# EAGLE design remote_control (EAGLE 7.1.0)
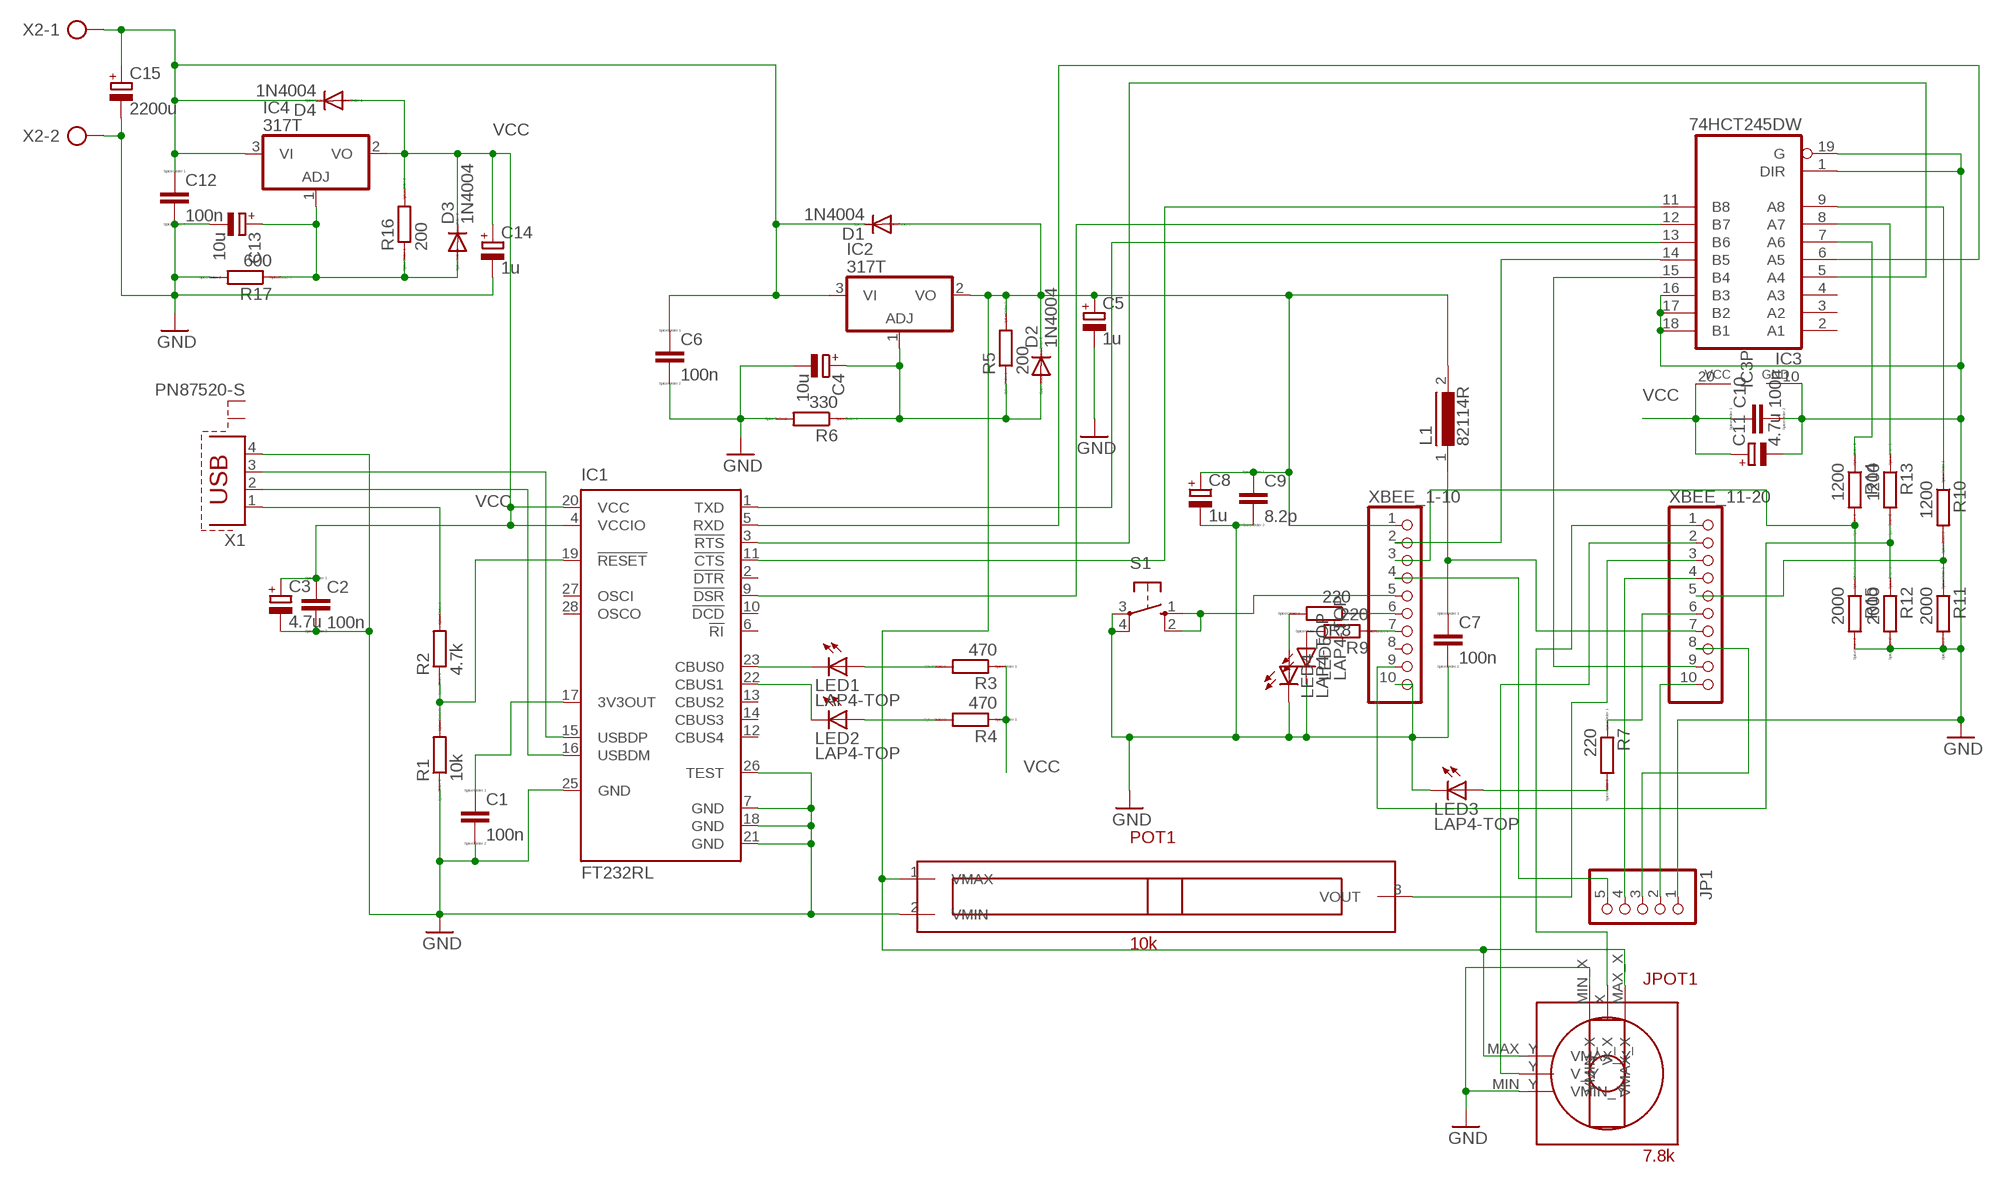
[diagram p0: schematic, sheet 1]

## Parts
C1  100n  C-EU025-030X050  [C025-030X050]
C2  100n  C-EUC0805K  [C0805K]
C3  4.7u  CPOL-EU153CLV-0605  [153CLV-0605]
C4  10u  CPOL-EUE5-8.5  [E5-8,5]
C5  1u  CPOL-EUE5-8.5  [E5-8,5]
C6  100n  C-EU025-030X050  [C025-030X050]
C7  100n  C-EU025-030X050  [C025-030X050]
C8  1u  CPOL-EUE5-8.5  [E5-8,5]
C9  8.2p  C-EU025-030X050  [C025-030X050]
C10  100n  C-EUC0805K  [C0805K]
C11  4.7u  CPOL-EU153CLV-0605  [153CLV-0605]
C12  100n  C-EU025-030X050  [C025-030X050]
C13  10u  CPOL-EUE5-8.5  [E5-8,5]
C14  1u  CPOL-EUE5-8.5  [E5-8,5]
C15  2200u  CPOL-EUE10-20  [EB20D]
D1  1N4004  [DO41-10]
D2  1N4004  [DO41-10]
D3  1N4004  [DO41-10]
D4  1N4004  [DO41-10]
IC1  FT232RL  [SSOP28]
IC2  317T  [TO220H]
IC3  74HCT245DW  [SO20W]
IC4  317T  [TO220H]
JP1  PINHD-1X5  [1X05]
JPOT1  7.8k  JOYSTICK_POTIP  [DIL]
L1  82114R  [82114R]
LED1  LAP4-TOP  [P47F-TOP]
LED2  LAP4-TOP  [P47F-TOP]
LED3  LAP4-TOP  [P47F-TOP]
LED4  LAP4-TOP  [P47F-TOP]
LED5  LAP4-TOP  [P47F-TOP]
POT1  10k  SCHIEBEPOTENTIOMETER  [DIL]
R1  10k  R-EU_0207_10  [0207/10]
R2  4.7k  R-EU_0207_10  [0207/10]
R3  470  R-EU_0207_10  [0207/10]
R4  470  R-EU_0207_10  [0207/10]
R5  200  R-EU_0411_15  [0411/15]
R6  330  R-EU_0411_15  [0411/15]
R7  220  R-EU_0207_10  [0207/10]
R8  220  R-EU_0207_10  [0207/10]
R9  220  R-EU_0207_10  [0207/10]
R10  1200  R-EU_0207_10  [0207/10]
R11  2000  R-EU_0207_10  [0207/10]
R12  2000  R-EU_0207_10  [0207/10]
R13  1200  R-EU_0207_10  [0207/10]
R14  1200  R-EU_0207_10  [0207/10]
R15  2000  R-EU_0207_10  [0207/10]
R16  200  R-EU_0411_15  [0411/15]
R17  600  R-EU_0411_15  [0411/15]
S1  40-XX  [B3F-40XX]
X1  PN87520-S  [PN87520-S]
X2  AK300/2  [AK300/2]
XBEE_1-10  PINHD-1X10M  [1X10M]
XBEE_11-20  PINHD-1X10M  [1X10M]

## Nets
GND: C1.2 C2.2 C3.- C4.- C5.- C6.2 C7.2 C8.- C9.2 C10.2 C11.- C12.2 C13.- C14.- C15.- IC1.7(GND) IC1.18(GND) IC1.21(GND) IC1.25(GND) IC1.26(TEST) IC3.1(DIR) IC3.10(GND) IC3.16(B3) IC3.17(B2) IC3.18(B1) IC3.19(G) JP1.1 JPOT1.MIN_X(VMIN_X) JPOT1.MIN_Y(VMIN_Y) LED3.C LED4.C LED5.C POT1.2(VMIN) R1.1 R6.2 R11.2 R12.2 R15.2 R17.2 S1.3(P) S1.4(P1) X1.4 X2.2 XBEE_1-10.10
N$1: R2.2 X1.1
N$2: IC1.19(!RESET) R1.2 R2.1
N$3: IC1.16(USBDM) X1.2
N$4: IC1.15(USBDP) X1.3
N$5: C1.1 IC1.17(3V3OUT)
N$6: S1.1(S) S1.2(S1) XBEE_1-10.5
N$7: C4.+ D2.A IC2.1(ADJ) R5.1 R6.1
N$8: LED3.A R7.2
N$9: IC1.23(CBUS0) LED1.C
N$10: IC1.22(CBUS1) LED2.C
N$11: LED1.A R3.2
N$12: LED2.A R4.2
N$13: R7.1 XBEE_11-20.6
N$14: C7.1 L1.1 XBEE_11-20.7
N$15: C5.+ C8.+ C9.1 D1.A D2.C IC2.2(VO) JPOT1.MAX_X(VMAX_X) JPOT1.MAX_Y(VMAX_Y) L1.2 POT1.1(VMAX) R5.2 XBEE_1-10.1
N$16: R8.1 XBEE_1-10.6
N$17: LED4.A R8.2
N$18: R9.1 XBEE_1-10.7
N$19: LED5.A R9.2
N$20: IC3.9(A8) R10.1
N$21: R10.2 R11.1 XBEE_11-20.5
N$22: R12.1 R13.2 XBEE_1-10.9
N$23: IC1.11(!CTS) IC3.11(B8)
N$24: IC3.8(A7) R13.1
N$25: IC1.9(!DSR) IC3.12(B7)
N$26: R14.2 R15.1 XBEE_1-10.3
N$27: IC3.7(A6) R14.1
N$28: JP1.2 XBEE_11-20.10
N$29: IC1.1(TXD) IC3.13(B6)
N$30: IC1.5(RXD) IC3.6(A5)
N$31: IC3.14(B5) XBEE_1-10.2
N$32: IC1.3(!RTS) IC3.5(A4)
N$33: IC3.15(B4) XBEE_11-20.9
N$34: JP1.3 XBEE_11-20.8
N$35: JP1.4 XBEE_11-20.4
N$36: JP1.5 XBEE_1-10.4
N$37: POT1.3(VOUT) XBEE_11-20.3
N$38: JPOT1.X(V_X) XBEE_11-20.1
N$39: JPOT1.Y(V_Y) XBEE_11-20.2
N$40: C13.+ D3.A IC4.1(ADJ) R16.1 R17.1
V: C6.1 C12.1 C15.+ D1.C D4.C IC2.3(VI) IC4.3(VI) X2.1
VCC: C2.1 C3.+ C10.1 C11.+ C14.+ D3.C D4.A IC1.4(VCCIO) IC1.20(VCC) IC3.20(VCC) IC4.2(VO) R3.1 R4.1 R16.2
Unconnected: IC1.2(!DTR) IC1.6(!RI) IC1.10(!DCD) IC1.12(CBUS4) IC1.13(CBUS2) IC1.14(CBUS3) IC1.27(OSCI) IC1.28(OSCO) IC3.2(A1) IC3.3(A2) IC3.4(A3) X1.S1 X1.S2 XBEE_1-10.8

## Library data of the parts
C1 C2 C6 C7 C9 C10 C12 = resistor:C-EU: CAPACITOR, European symbol; SPICEPREFIX: C
C3-C5 C8 C11 C13-C15 = resistor:CPOL-EU: POLARIZED CAPACITOR, European symbol
D1-D4 = diode:1N4004: DIODE general purpose rectifier, 1 A
IC1 = ftdichip:FT232R: Source: http://www.ftdichip.com/Documents/DataSheets/DS_FT232R_v104.pdf; MPN: FT232RL; OC_FARNELL: 1146032; OC_NEWARK: 91K9918
IC2 IC4 = linear:*317: Positive VOLTAGE REGULATOR
IC3 = 74xx-eu:74*245: Octal BUS TRANSCEIVER, 3-state
JP1 = pinhead:PINHD-1X5: PIN HEADER
JPOT1 = joystick:JOYSTICK_POTI
L1 = inductors:82114R: INDUCTOR
LED1-LED5 = led:*P4: PointLED® Enhanced Thinfilm LED TOP & BOTTOM mount LS P47F, LR P47F, LA P47F, LY P47F, LT P4SG, LB P4SG, LW P4SG Source: http://catalog.osram-os.com .. LA_LR_LS_LY_P47F_Pb_free.pdf
POT1 = Schiebepotentiometer:SCHIEBEPOTENTIOMETER
R1-R17 = resistor:R-EU_: RESISTOR, European symbol; SPICEPREFIX: R
S1 = switch-omron:40-XX: OMRON SWITCH; MF: OMRON COMPONENTS USA; MPN: B3F-4000; OC_FARNELL: 176434; OC_NEWARK: 36K3105
X1 = con-berg:PN87520-S; OC_FARNELL: unknown; OC_NEWARK: unknown
X2 = con-ptr500:AK300/2: CONNECTOR; OC_FARNELL: unknown; OC_NEWARK: unknown
XBEE_1-10 XBEE_11-20 = pinhead:PINHD-1X10: PIN HEADER

## Board
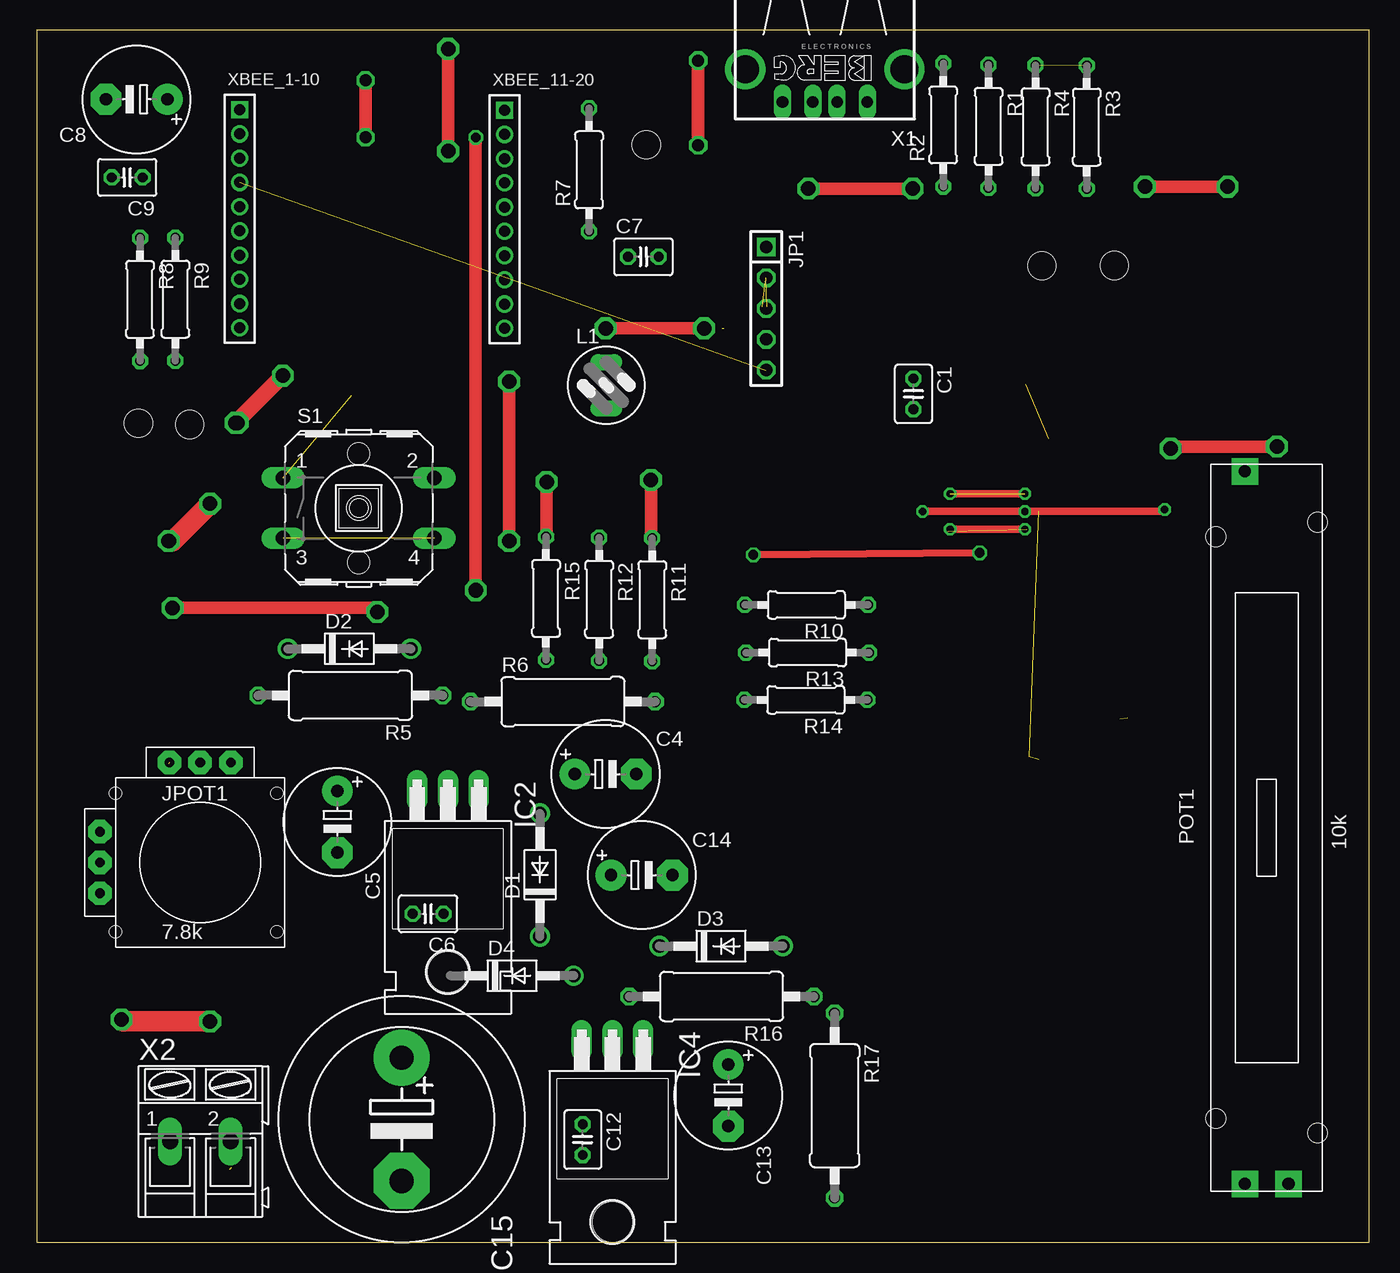
[diagram p1: board, top side]
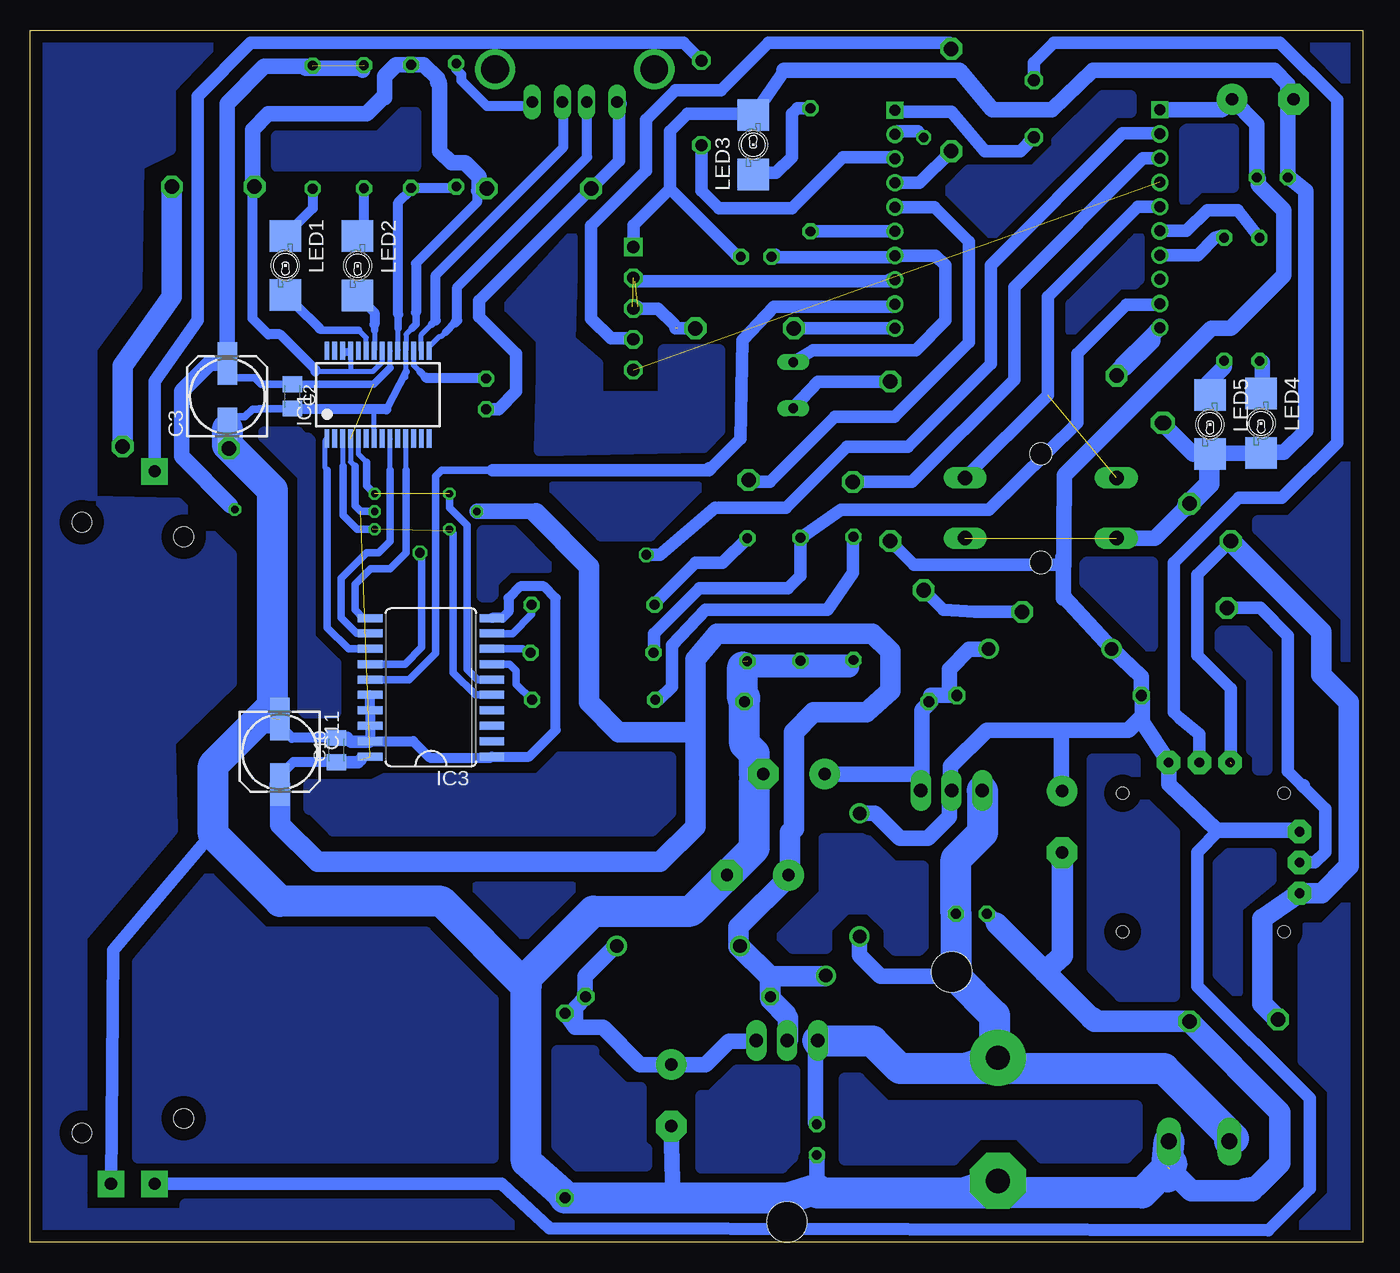
[diagram p2: board, bottom side, seen from below]

Size 110 x 100 mm. Coordinates in mm from the lower left corner, seen from the top.
Outline: 0,0 110,0 110,100 0,100 0,0
Copper layers (1*16): Top 0.035mm / dielectric 1.5mm / Bottom 0.035mm
Design rules "default": minimum track width 10mil, minimum drill 24mil, track to track 8mil, track to pad 8mil, pad to pad 8mil, via to via 8mil, smd to smd 8mil, copper to edge 40mil, drill to drill 8mil, minimum pad ring 10mil, minimum via ring 8mil, stop-mask expansion 4mil, vias tented up to drill 0mil, thermal gap 10mil

### Footprints (pad centres in the part's own frame; a part is rotated, then mirrored left to right if it is on the bottom)
C025-030X050 = drill 0.813 octagon: 1 -1.27,0; 2 1.27,0
C0805K = smd 1.3 x 1.6: 1 -1,0; 2 1,0
153CLV-0605 = smd 3.5 x 1.6: + 2.7,0; - -2.7,0
E5-8,5 = drill 1.016 pad 2.54: + -2.54,0 | drill 1.016 pad 2.54 octagon: - 2.54,0
EB20D = drill 2.007 pad 4.597: + -5.08,0 | drill 2.007 pad 4.597 octagon: - 5.08,0
DO41-10 = drill 1.118: A 5.08,0; C -5.08,0
SSOP28 = smd 0.4 x 1.5: 1 -4.225,-3.625; 2 -3.575,-3.625; 3 -2.925,-3.625; 4 -2.275,-3.625; 5 -1.625,-3.625; 6 -0.975,-3.625; 7 -0.325,-3.625; 8 0.325,-3.625; 9 0.975,-3.625; 10 1.625,-3.625; 11 2.275,-3.625; 12 2.925,-3.625; 13 3.575,-3.625; 14 4.225,-3.625; 15 4.225,3.625; 16 3.575,3.625; 17 2.925,3.625; 18 2.275,3.625; 19 1.625,3.625; 20 0.975,3.625; 21 0.325,3.625; 22 -0.325,3.625; 23 -0.975,3.625; 24 -1.625,3.625; 25 -2.275,3.625; 26 -2.925,3.625; 27 -3.575,3.625; 28 -4.225,3.625
TO220H = drill 1.118 long: 1 -2.54,-10.16; 2 0,-10.16; 3 2.54,-10.16 | hole 3.302: 0,4.826
SO20W = smd 0.66 x 2.032: 1 -5.715,-5.029; 2 -4.445,-5.029; 3 -3.175,-5.029; 4 -1.905,-5.029; 5 -0.635,-5.029; 6 0.635,-5.029; 7 1.905,-5.029; 8 3.175,-5.029; 9 4.445,-5.029; 10 5.715,-5.029; 11 5.715,5.029; 12 4.445,5.029; 13 3.175,5.029; 14 1.905,5.029; 15 0.635,5.029; 16 -0.635,5.029; 17 -1.905,5.029; 18 -3.175,5.029; 19 -4.445,5.029; 20 -5.715,5.029
1X05 = drill 1.016 square: 1 -5.08,0 | drill 1.016 octagon: 2 -2.54,0; 3 0,0; 4 2.54,0; 5 5.08,0
DIL = drill 0.8 pad 1.93 octagon: MAX_X 2.54,8.255; MAX_Y -8.255,2.54; MIN_X -2.54,8.255; MIN_Y -8.255,-2.54; X 0,8.255; Y -8.255,0 | hole 1: 6.35,5.715; 6.35,-5.715; -6.985,-5.715; -6.985,5.715
82114R = drill 0.813 long: 1 0,1.905; 2 0,-1.905
P47F-TOP = smd 2.6 x 2.6: A -2.45,0; C 2.45,0 | hole 2.3: 0,0
DIL' = drill 1 pad 2.184 square: 1 -29.4,1.8; 2 -29.4,-1.8; 3 29.4,1.8 | hole 1.6: 25.2,-4.2; -25.2,-4.2; 24,4.2; -24,4.2
0207/10 = drill 0.813 octagon: 1 -5.08,0; 2 5.08,0
0411/15 = drill 0.914 octagon: 1 -7.62,0; 2 7.62,0
B3F-40XX = drill 1.194 long: 1 -6.248,2.489; 2 6.248,2.489; 3 -6.248,-2.489; 4 6.248,-2.489 | hole 1.803: 0,-4.496; 0,4.496
PN87520-S = drill 0.95 long: 1 -3.5,2.71; 2 -1,2.71; 3 1,2.71; 4 3.5,2.71 | drill 2.3 pad 2.9: S1 -6.57,0; S2 6.57,0
AK300/2 = drill 1.321 long: 1 -2.515,0; 2 2.489,0
1X10M = drill 0.914 square: 1 -9,0 | drill 0.914: 2 -7,0; 3 -5,0; 4 -3,0; 5 -1,0; 6 1,0; 7 3,0; 8 5,0; 9 7,0; 10 9,0

### Placement (x,y rotation side)
C1  72.37,69.99 270 top
C2  88.34,69.78 270 bottom
C3  93.74,69.81 90 bottom
C4  46.95,38.62 0 top
C5  24.81,34.67 270 top
C6  32.3,27.08 180 top
C7  50.08,81.31 0 top
C8  8.24,94.31 180 top
C9  7.46,87.85 180 top
C10  84.72,40.6 90 bottom
C11  89.4,40.45 270 bottom
C12  45.07,8.45 270 top
C13  57.09,12.1 270 top
C14  49.95,30.28 0 top
C15  30.12,10.13 270 top
D1  41.54,30.3 90 top
D2  25.8,48.95 0 top
D3  56.49,24.42 0 top
D4  39.24,21.98 0 top
IC1  81.29,69.93 0 bottom
IC2  33.94,27.11 180 top
IC3  76.92,45.78 90 bottom
IC4  47.52,6.47 180 top
JP1  60.21,77.03 270 top
JPOT1  13.48,31.32 0 top
L1  47.02,70.71 0 top
LED1  88.94,80.59 270 bottom
LED2  82.98,80.56 270 bottom
LED3  50.31,90.55 90 bottom
LED4  8.39,67.56 270 bottom
LED5  12.62,67.47 270 bottom
POT1  10k  [DIL']  101.53,34.2 90 top
R1  78.57,92.06 270 top
R2  74.83,92.19 90 top
R3  86.68,92.01 270 top
R4  82.45,92.04 270 top
R5  25.89,45.1 180 top
R6  43.43,44.6 0 top
R7  45.59,88.47 90 top
R8  8.52,77.79 270 top
R9  11.44,77.81 270 top
R10  63.54,52.58 180 top
R11  50.81,53.01 270 top
R12  46.42,53.04 270 top
R13  63.62,48.64 180 top
R14  63.49,44.74 180 top
R15  42.03,53.11 270 top
R16  56.53,20.26 180 top
R17  65.87,11.26 270 top
S1  26.58,60.57 0 top
X1  65.06,96.8 180 top
X2  13.51,8.3 0 top
XBEE_1-10  16.74,84.44 270 top
XBEE_11-20  38.62,84.41 270 top

### Tracks (layer width: path | path; a pad name or v marks a point on that pad's centre or on a via)
GND  (via drill 1.2)  (5 unrouted)
  Top 1.016: v63.7,86.94 v72.31,86.94
  Top 1.27: v16.41,67.6 v20.31,71.5
  Top 1.676: v14.3,18.2 7.15,18.2 v6.99,18.36 | v10.89,57.85 11.21,57.85 v14.3,60.94
  Bottom 0.406: IC1.7 81.61,68.7 | 78.97,73.52 IC1.18 78.97,73.59 | 78.49,75.4 78.97,74.91 78.97,73.59 | IC1.26 IC1.25 83.56,71.86 83.53,71.83 | 80.97,72.6 80.92,72.64 80.92,73.52 IC1.21 80.97,72.6 | 80.97,72.6 81.74,71.83 83.53,71.83 | 83.53,71.83 86.45,71.83 | 78.97,71.34 78.97,71.83 78.97,73.59
  Bottom 0.61: 81.61,68.7 81.7,68.78 C2.2 91.12,68.78 91.16,68.74 91.65,68.74 92.3,68.09 93.44,68.09 93.76,68.41 93.76,67.13 C3.- | 78.16,76.7 78.16,75.72 78.49,75.4 | 80.6,68.72 78.97,71.83
  Bottom 0.813: C10.2 88.4,41.6 89.38,42.58 89.38,43.13 C11.- | IC3.16 IC3.17 IC3.18 IC3.19 78.39,41.34 77.03,39.98 71.98,39.98 IC3.1 68.81,40.06 66.62,42.25 66.62,53.14 67.6,54.11 69.55,54.11 70.53,53.14 70.53,52 71.01,51.51 71.87,51.51 IC3.10 | 74.1,89.05 75.4,89.05 76.05,89.7 76.05,95.88 77.35,97.17 77.38,97.14 R1.1 78.6,97.17 79.95,97.17 80.76,96.36 80.76,96.2 | 73.12,88.08 73.12,86.78 73.12,85.8 78.16,80.76 78.16,76.7 | 86.45,71.83 86.45,71.99 89.38,74.91 90.35,74.91 91.65,76.21 91.65,87.1 | 91.65,91.81 91.65,91.97 90.51,93.11 90.35,93.11 | 82.22,93.11 82.06,93.11 80.76,94.41 | 80.6,68.72 88.28,68.72 C2.2 | R15.2 51.35,48.1 51.13,47.88 51.13,45.33 R6.2
  Bottom 1.016: C10.2 83.85,41.6 83.53,41.27 82.01,41.27 IC3.19 | POT1.2 103.17,24.07 94.9,33.8 | R12.2 50.78,47.96 R11.2 | 47.77,96.69 47.72,96.75 LED3.C 50.42,93.11 55.74,93.11 57.2,91.65 57.2,86.94 | 10.89,39.49 11.21,39.49 10.89,39.81 10.89,45.66 13.65,48.42 13.65,55.09 v10.89,57.85 | 61.4,93.92 61.4,89.24 v63.7,86.94 72.96,77.67 72.96,76.38 69.88,73.29 69.88,70.2 71.36,68.72 C1.2 | v72.31,86.94 72.96,86.94 73.12,86.78 | C7.2 51.73,81.47 57.2,86.94 | JP1.1 60.21,83.93 57.2,86.94
  Bottom 1.27: 45.07,4.12 45.07,4.39 C12.2 | C13.- 56.93,3.58 56.55,3.64 | 16.09,5.36 16.09,5.2 | 22.48,18.52 26.27,22.32 C6.2 | 6.19,93.81 C9.2 6.12,87.85 4.71,86.78 4.71,66.95 6.5,65.16 8.33,65.16 LED4.C 12.53,65.11 LED5.C | 6.19,93.81 C8.- | LED5.C 13.99,65.02 16.57,67.6 v16.41,67.6 | v20.31,71.5 20.31,71.88 XBEE_1-10.10 | S1.3 17.15,58.08 14.46,60.77 v14.3,60.94 12.68,62.56 12.68,64.96 LED5.C | 6.19,93.81 6.19,95.57 7.31,96.69 22.26,96.69 25.68,93.44 30.55,93.44 33.31,96.69 47.77,96.69 | 61.4,93.92 X1.4 | 91.65,87.1 91.65,91.81 90.35,93.11 82.22,93.11 80.92,94.41 80.76,94.41 80.76,96.2 79.79,97.17 77.51,97.17 76.38,96.04 76.38,95.71 76.21,95.55 76.21,90.03 75.24,89.05 74.1,89.05 73.12,88.08 72.96,87.91 72.96,86.78
  Bottom 1.676: v6.99,18.36 8.29,19.66 8.29,26.7 JPOT1.MIN_Y 3.39,28.78 1.14,31.04 1.14,44.52 3.41,46.8 3.41,50.38 v10.89,57.85 | 10.89,39.63 JPOT1.MIN_X | 14.46,60.77 12.68,62.56 12.68,65 12.51,65.16
  Bottom 1.778: 15.93,6.01 14.14,4.22 9.1,4.22 9.75,4.39 8.78,4.55 6.83,6.5 6.83,10.72 v14.3,18.2 22.15,18.2 22.48,18.52 | C5.- 24.81,23.62 26.27,22.32
  Bottom 2.54: X2.2 16.25,5.86 | 16.25,5.86 16.4,5.86 18.2,4.06 33.03,4.06 C15.- 30.13,4.06 45.01,4.06 45.07,4.12 | 45.07,4.39 47.45,3.64 56.55,3.64 R17.2 66.2,4.12 69.06,6.66 69.06,21.12 | 16.09,5.36 16.09,6.17 15.76,6.5 15.76,6.35 16.25,5.86 | 69.06,21.12 69.06,21.77 63.54,27.3 55.47,27.3 C14.- 52.44,30.28 50.21,32.5 50.21,37.9 C4.- 50.16,38.62 50.21,38.67 50.21,40.3 51.02,41.11 51.02,44.95 R6.2 | 69.06,21.12 76.05,28.11 89.38,28.11 94.9,33.64 94.9,33.8 94.9,39.33 90.35,43.88 90.35,43.71 90.03,43.39 | 90.03,43.39 90.03,43.23 90.35,43.23 | C3.- 93.74,65.79 90.03,62.08 90.03,43.39
N$1
  Bottom 0.813: R2.2 74.83,96.77 74.42,96.36 74.42,95.88 72.31,93.76 68.88,93.76 X1.1
N$2
  Bottom 0.406: IC1.19 79.62,73.59 79.62,75.4
  Bottom 0.61: 79.62,75.4 79.62,76.54
  Bottom 0.813: 79.62,76.54 79.62,85.8 78.57,86.85 R1.2 74.95,86.98 R2.1
N$3
  Bottom 0.406: IC1.16 77.72,74.87 76.86,75.72
  Bottom 0.61: 76.86,75.72 76.54,76.05
  Bottom 0.813: 76.54,76.05 76.54,79.79 65.97,90.35 65.97,94 X1.2
N$4
  Bottom 0.406: IC1.15 77.06,73.9 76.21,74.75 76.05,74.75 75.72,75.08
  Bottom 0.61: 75.72,75.08 74.91,75.89
  Bottom 0.813: 74.91,75.89 74.75,76.05 74.75,78.81 64.03,89.54 64.03,94.05 X1.3
N$5
  Bottom 0.406: IC1.17 78.36,72.35 77.84,71.83
  Bottom 0.61: 77.84,71.83 77.35,71.34
  Bottom 0.813: 77.35,71.34 72.45,71.34 C1.1
N$6  (1 unrouted)
  Bottom 1.016: XBEE_1-10.5 18.55,85.44 26,78 26,69.89 S1.2
N$7
  Bottom 1.27: 36.54,37.21 IC2.1 | 36.66,37.45 IC2.1 | 36.4,38.35 36.4,43.88 35.65,44.63 R6.1 35.63,45.1 34.12,45.1 | 36.4,38.35 36.4,37.35 IC2.1 | C4.+ 36.67,38.62 36.4,38.35 | R5.1 34.12,45.1 | 34.12,45.1 34.12,47.29 32.5,48.91 30.92,48.91 D2.A
N$8
  Bottom 1.016: R7.2 46.68,93.56 47.12,93.11 47.12,89.54 48.42,88.24 50.18,88.24 LED3.A
N$9
  Bottom 0.406: IC1.23 82.27,74.63 82.88,75.24
  Bottom 0.61: 82.88,75.24 86.04,75.24 LED1.C
N$10
  Bottom 0.406: LED2.C 82.06,77.19 | 81.58,75.24 81.58,73.59 IC1.22
  Bottom 0.61: 81.58,75.72 81.58,75.24
  Bottom 0.813: 82.06,77.19 81.58,76.7 81.58,75.72
N$11
  Bottom 0.813: R3.2 86.68,85.3 LED1.A
N$12
  Bottom 0.813: LED2.A 82.45,83.53 R4.2
N$13
  Bottom 1.016: R7.1 38.64,83.39 XBEE_11-20.6
N$14
  Bottom 1.016: C7.1 48.48,81.47 48.26,81.25 38.78,81.25 XBEE_11-20.7 35.26,81.41 34.45,80.6 34.45,76.05 36.89,73.61 45.37,73.61 L1.1
N$15  (via drill 1.2)
  Top 1.016: v39,57.85 v39,71.01
  Bottom 1.016: POT1.1 71.1,4.8 67.11,1.14 7.8,0.97 4.39,4.39 4.39,11.86 13.65,21.12 13.65,32.17 11.86,33.96 | 24.62,63.29 24.62,55.98 24.86,55.74 24.86,55.9 | 24.86,56.55 24.86,55.9 | 24.86,55.9 37.05,55.9 v39,57.85 | v39,71.01 44.98,71.01 L1.2
  Bottom 1.27: 24.86,42.25 31.04,42.25 34.03,39.26 34.03,37.37 IC2.2 34.12,37.09 34.12,35.1 35.91,33.31 38.19,33.31 40.26,35.38 D1.A | 24.86,42.25 19.34,42.25 18.2,43.39 | 18.2,43.39 18.2,45.03 R5.2 18.27,46.67 D2.C 24.7,53.3 24.7,53.14 24.62,63.29 12.51,75.4 10.89,75.4 6.5,79.79 6.5,85.15 8.61,87.26 8.61,87.73 C9.1 8.73,92.25 C8.+ | C5.+ 24.86,37.27 24.86,42.25 | XBEE_1-10.1 11.64,93.44 C8.+ | 11.17,93.92 C8.+ | 18.2,43.39 18.2,42.9 JPOT1.MAX_X 16.02,37.8 12.03,33.96 11.86,33.96 5.29,33.96 | 5.2,33.96 5.29,33.96 | 5.29,33.96 JPOT1.MAX_Y
N$16
  Bottom 1.016: XBEE_1-10.6 14.54,83.44 12.84,85.15 10.31,85.15 R8.1
N$17
  Bottom 1.27: LED4.A 8.39,70.75 8.29,70.85 8.29,72.61 R8.2
N$18
  Bottom 1.016: XBEE_1-10.7 13.62,81.44 12.19,82.88 11.62,83.04 R9.1
N$19
  Bottom 1.27: R9.2 11.44,72.25 12.84,70.85 12.84,70.14 LED5.A
N$20
  Bottom 0.61: R10.1 68.62,51.8 70.2,50.21 71.88,50.21 IC3.9
N$21  (via drill 1.2)
  Top 1.016: v50.7,62.89 50.7,58.2 R11.1
  Bottom 1.016: R10.2 58.46,52.69 55.09,56.06 52.84,56.06 R11.1 | XBEE_11-20.5 35.36,85.41 32.5,82.55 32.5,74.26 38.67,68.09 43.55,68.09 48.91,62.73 50.54,62.73 v50.7,62.89
N$22
  Bottom 1.016: 58.5,48.75 58.5,50.21 54.76,53.95 47.45,53.95 46.42,54.98 R12.1 46.37,58.12 43.06,60.45 30.88,60.45 23.56,67.6 23.56,73.29 19.5,77.35 16.84,77.35 XBEE_1-10.9 | 58.5,48.69 R13.2 58.55,48.7 58.5,48.75 | 58.5,48.69 58.5,48.59 58.66,48.75 58.5,48.75 | 58.5,48.75 58.5,48.69
N$23
  Bottom 0.406: 78.97,63.7 78.97,66.27 IC1.11
  Bottom 0.61: IC3.11 82.53,51.49 83.2,52.16 83.2,54.27 81.9,55.58 80.28,55.58 78.97,56.88 78.97,63.7
N$24
  Bottom 0.61: IC3.8 69.34,48.95 R13.1
N$25
  Bottom 0.406: 80.28,63.7 80.28,66.27 IC1.9
  Bottom 0.61: IC3.12 83.05,50.23 84.34,51.51 84.34,54.76 82.22,56.88 81.25,56.88 80.28,57.85 80.28,63.7
N$26  (via drill 1.2)
  Top 1.016: v42.09,62.73 42.09,58.24 R15.1
  Bottom 1.016: R14.2 58.12,44.74 57.04,45.83 57.04,49.24 54.27,52.16 44.2,52.16 42.09,55.25 42.09,58.14 R15.1 | XBEE_1-10.3 18.13,89.44 28.76,78.81 28.76,71.17 37.21,62.73 v42.09,62.73
N$27
  Bottom 0.61: IC3.7 70.44,47.69 69.88,47.12 69.88,46.05 R14.1
N$28  (via drill 1.2)  (2 unrouted)
  Top 1.016: v46.96,75.4 v55.09,75.4
  Bottom 1.016: XBEE_11-20.10 v46.95,75.41 v46.96,75.4 | v55.09,75.4 56.55,75.4 | 56.71,75.4 56.88,75.72 58.17,77.03 60.12,77.03 60.29,77.19
N$29
  Bottom 0.406: 85.47,63.7 85.64,63.86 85.64,66.18 IC1.1
  Bottom 0.61: IC3.13 83.73,48.95 85.47,50.7 85.47,63.7
N$30  (1 unrouted)
  Bottom 0.406: IC1.5 82.92,65.04 82.22,64.35
  Bottom 0.61: IC3.6 73.06,46.41 73.94,47.29 73.94,59.15 75.4,60.61 75.4,61.75 | 82.22,64.35 82.22,62.4 81.58,61.75
N$31  (via drill 0.8)
  Top 0.61: v77.84,56.88 v59.15,56.71
  Bottom 0.61: IC3.14 79.06,47.69 77.67,49.08 77.67,56.71 v77.84,56.88 | v59.15,56.71 58.99,56.71 | 58.01,56.71 56.71,57.85 53.14,60.61
  Bottom 1.016: 53.14,60.61 47.61,60.61 42.58,65.65 37.54,65.65 30.71,72.47 30.71,80.6 19.82,91.49 16.79,91.49 XBEE_1-10.2 | 53.46,60.61 58.01,56.71 58.99,56.71
N$32  (1 unrouted)
  Bottom 0.406: IC1.3 84.22,64.06 84.17,64.03
  Bottom 0.61: IC3.5 73.26,45.15 75.08,46.96 75.08,58.5 75.24,58.66 | 84.17,64.03 84.17,59.96 83.04,58.83 81.74,58.83
N$33
  Bottom 0.61: IC3.15 78.71,46.41 76.54,48.59 76.54,63.21 76.05,63.7 71.83,63.7
  Bottom 1.016: 71.83,63.7 53.95,63.7 53.95,63.86 53.79,63.86 51.35,66.3 51.19,74.42 48.59,77.19 38.84,77.19 XBEE_11-20.9
N$34  (1 unrouted)
  Bottom 1.016: XBEE_11-20.8 39.05,79.41 39.16,79.3 60.12,79.3 60.45,79.62 | 59.87,77.19 JP1.3
N$35  (via drill 1.2)
  Top 1.016: v33.96,90.03 v33.96,98.47
  Bottom 1.016: XBEE_11-20.4 36.58,87.41 v33.96,90.03 | v33.96,98.47 33.96,98.8 34.12,98.96 49.08,98.96 52.98,95.06 56.71,95.06 59.15,92.62 59.15,88.4 63.7,83.85 63.7,76.21 62.08,74.59 60.3,74.59 JP1.4
N$36  (1 unrouted)
N$37  (via drill 1)
  Top 1.016: v54.6,97.5 v54.6,90.51
  Bottom 1.016: POT1.3 99.73,71.05 96.2,76.05 96.2,94.58 91.81,98.96 56.06,98.96 v54.6,97.5 | v54.6,90.51 54.6,86.78 53.14,85.31 47.12,85.31 42.9,89.54 38.76,89.54 XBEE_11-20.3
N$38  (via drill 1)
  Top 1.016: v27.14,95.88 v27.14,91.16
  Bottom 1.016: JPOT1.X 13.48,41.92 15.11,43.23 15.6,43.71 15.59,56.07 10.24,61.42 6.66,61.42 2.11,65.97 2.11,94.25 6.83,98.96 25.51,98.96 27.14,97.34 v27.14,95.88 | v27.14,91.16 28.27,90.03 31.2,90.03 33.96,93.28 38.49,93.28 XBEE_11-20.1
N$39  (via drill 0.8, 1.2)
  Top 1.016: v11.21,52.33 27.79,52.33 v28.11,52 | v36.24,53.79 v36.24,91.16
  Bottom 1.016: JPOT1.Y 3.94,31.32 3.09,32.17 3.09,35.75 4.88,37.54 4.88,37.7 5.04,37.7 6.17,38.84 6.17,50.05 8.45,52.33 v11.21,52.33 | v28.11,52 32.01,52 34.61,52.16 v36.24,53.79 | v36.24,91.16 36.73,91.65 38.38,91.65 XBEE_11-20.2
N$40
  Bottom 1.27: IC4.1 50.12,16.57 52.33,16.57 54.26,14.64 C13.+ 59.66,14.64 62.73,17.71 65.03,17.71 R17.1 65,17.8 65,19.34 64.15,20.19 R16.1 | R16.1 64.24,20.26 | D3.A 61.71,24.42 64.19,21.94 64.19,20.3 R16.1
N$41
  Bottom 1.778: 22.26,18.52 22.43,18.52 30.23,26.32
N$42
  Bottom 1.676: 55.41,42.09 61.42,42.09 63.86,44.52 63.86,55.74 68.25,60.12
N$43  (via drill 0.6)
  Top 0.61: v93.11,60.45 92.95,60.29 v81.58,60.29 v73.12,60.29 72.96,60.29
  Bottom 1.27: 68.41,60.29 v73.12,60.29
N$44
  Bottom 1.27: 87.26,96.85 82.71,96.85 82.55,97.01 82.55,96.69
N$45  (via drill 0.6)
  Top 0.61: v81.58,58.83 v75.4,58.83 75.4,58.66
N$46  (via drill 0.6)
  Top 0.61: v75.4,61.75 v81.58,61.75
N$47
  Bottom 0.813: 88.24,77.35 88.08,77.35 86.12,75.4
N$48
  Bottom 0.406: 83.69,73.29 84.01,73.29
N$49
  Bottom 2.54: 51.19,44.85 51.19,47.45
N$50
  Bottom 1.676: 50.7,47.45 42.41,47.45
N$51
  Bottom 1.27: 16.74,75.56 20.15,71.66
N$52  (via drill 1.2)
  other vias: 20.31,71.5
N$53  (via drill 1.2)
  other vias: 16.57,67.6
N$56
  Bottom 1.676: 19.66,72.31 17.55,74.42
N$57
  pour Bottom: 71.83,6.99 101.08,6.99 101.08,23.07 95.22,30.06 90.67,25.51 77.35,25.51 71.83,19.99
N$58
  pour Bottom: 95.22,8.45 99.29,8.45 99.29,11.86 95.22,11.86
N$59
  pour Bottom: 94.74,99.12 109.2,99.12 109.2,4.55 105.79,4.22 105.79,25.19 98.31,33.96 98.47,41.27 93.44,46.15 93.44,56.71 97.83,60.94 104.97,61.1 104.97,73.78 101.24,78.81 101.08,88.89 98.47,90.19 98.47,95.22
N$60
  pour Bottom: 69.71,0.81 108.71,1.14 108.71,3.9 105.79,3.9 105.79,2.76 105.79,2.27 97.83,2.27 97.17,2.27 97.17,3.09 72.15,3.09
N$61
  pour Bottom: 54.44,65.65 67.92,65.33 67.76,71.5 67.76,74.42 70.53,77.19 65.33,82.88 65.33,79.79 65.49,74.42 63.21,72.47 63.21,69.71 57.69,69.71 57.69,73.61 53.14,73.61 53.14,66.95
N$62
  pour Bottom: 58.66,33.96 84.99,33.96 86.78,35.75 86.94,35.75 86.94,37.7 81.74,37.7 80.76,38.19 68.09,38.19 66.3,39.98 57.2,39.98 57.2,35.42
N$63
  pour Bottom: 55.41,62.24 66.79,62.24 62.89,58.34 58.83,58.34 54.92,62.24
N$64
  pour Bottom: 72.64,58.66 72.64,53.3 71.99,53.3 71.83,53.46 71.83,53.95 71.83,54.44 70.53,55.74 67.28,55.74 70.2,58.66
N$65
  pour Bottom: 66.95,29.25 73.12,29.25 69.22,25.35 65.33,29.25
N$66
  pour Bottom: 4.71,0.49 0.49,0.49 0.65,0.65 0.65,28.44 3.25,25.84 4.71,25.84 4.88,25.68 4.88,14.95 2.44,12.51 2.44,11.54 2.44,3.9 5.85,0.49
N$67
  pour Bottom: 0.97,64.35 0.65,64.03 1.3,48.1 1.3,48.26 1.3,51.51 8.61,58.83 8.61,59.48 6.01,59.48 1.14,64.35
N$68
  pour Bottom: 22.26,39.81 22.26,22.59 20.15,20.48 19.99,20.31 15.6,20.31 15.6,33.8 18.85,37.05 18.85,39.81
N$69
  pour Bottom: 7.64,32.01 11.05,32.01 11.86,31.2 11.86,22.1 10.4,20.64 10.4,27.62 7.64,29.9
N$70
  pour Bottom: 28.44,88.4 32.5,88.4 34.12,86.78 30.55,83.2 20.48,93.28 19.18,93.28 19.18,94.58 21.45,94.58 25.19,90.84 25.19,90.35 27.14,88.4
N$71
  pour Bottom: 14.46,91.81 14.62,91.65 14.62,85.96 13.49,87.1 10.72,87.1 10.72,91.81
N$72
  pour Bottom: 18.69,11.21 39.33,11.21 41.6,13.49 42.74,13.49 42.74,6.83 33.8,6.83 31.69,8.94 31.36,8.94 28.44,8.94 26.49,6.99 25.68,6.99 19.5,6.99 18.69,7.8
N$73
  pour Bottom: 47.12,14.14 51.67,14.14 53.79,12.03 54.6,12.03 54.6,6.17 47.94,6.17 47.12,6.99 47.12,7.31 46.96,7.47 46.96,14.14
N$74
  pour Bottom: 63.54,15.76 66.46,15.76 66.46,7.96 64.84,6.34 64.67,6.34 59.15,6.34 59.15,7.64 59.64,8.12 59.64,12.68 60.94,12.68 63.54,15.28
N$75
  pour Bottom: 17.88,56.06 22.75,56.06 22.91,55.9 22.91,54.44 17.55,49.08 17.39,49.24 17.39,56.06
N$76
  pour Bottom: 84.83,47.61 84.83,44.04 84.83,43.71 87.26,43.71 87.42,43.88 87.42,63.21 90.67,66.46 90.67,66.79 87.91,66.79 87.42,66.3 87.1,66.3 86.94,66.14 86.94,63.54 86.94,49.89 84.83,47.77
N$77
  pour Bottom: 10.07,50.38 11.54,50.38 11.7,50.21 11.7,49.08 9.1,46.48 9.1,40.62 8.61,40.14 8.61,39 7.96,39 7.96,48.59 9.75,50.38 9.91,50.38
N$78
  pour Bottom: 19.01,82.39 24.05,77.35 24.05,75.24 20.15,79.14 19.5,79.14 18.85,79.14 18.52,79.46 18.52,82.88
N$79
  pour Bottom: 0.81,95.39 4.55,99.12 0.81,99.12
N$80  (via drill 1.2)
  other vias: 93.6,65.49
N$81  (via drill 1.2)
  Bottom 1.676: v102.38,65.65 102.38,72.31 98.31,78 98.31,86.94
N$82  (via drill 1.2)
  Top 1.016: v91.49,87.1 v98.31,87.1
N$83
  pour Bottom: 88.56,91.33 81.74,91.33 81.25,91.33 79.3,93.28 79.14,93.28 78.16,93.28 78.16,88.89 78.16,88.72 89.7,88.72 89.7,91.33
N$84
  Top 1.016: 93.6,65.65 102.54,65.65
N$85
  pour Bottom: 36.24,31.04 38.67,31.04 40.79,33.15 41.11,33.15 41.27,33.31 44.52,33.31 44.52,28.76 48.1,25.19 47.12,24.21 46.96,24.21 44.2,24.21 44.2,25.84 42.58,27.46 40.79,27.46 39.16,25.84 39.16,25.68 39.16,24.54 38.67,24.05 36.56,24.05 36.4,24.21 36.24,24.38
V
  Bottom 1.27: 44.85,16.57 44.85,15.76 45.17,15.44 45.17,9.82 C12.1 | 31.42,37.25 IC2.3 | D1.C 41.54,23.66 39.81,21.94 34.2,21.94 D4.C
  Bottom 1.676: D4.C | 30.23,14.34 C15.+
  Bottom 2.54: X2.1 10.67,8.55 16.41,14.3 32.98,14.3 | 32.98,14.3 C15.+ 30.39,14.5 30.39,18.69 33.67,21.97 D4.C | 32.98,14.3 38.19,14.3 40.46,16.57 44.69,16.57 | 44.85,16.57 44.92,16.57 IC4.3 44.95,16.64 44.85,16.74 44.85,16.57 | 44.85,16.57 44.85,16.41 44.69,16.57 | 44.69,16.57 44.85,16.57 | D4.C 33.57,22.57 C6.1 33.57,31.59 31.36,33.8 31.36,37.23 IC2.3
VCC  (4 unrouted)
  Bottom 0.406: IC1.4 83.56,64.39 83.2,64.03 | 80.28,72.15 80.28,73.52 IC1.20
  Bottom 0.61: 83.2,64.03 83.2,60.77 82.71,60.29 81.58,60.29 | 80.28,72.15 81.64,70.78 C2.1 90.93,70.78 91.49,71.34 93.11,71.34 93.28,71.5 93.28,72.04 C3.+
  Bottom 0.813: C10.1 88.29,39.6 89.05,38.84 89.05,38.1 C11.+
  Bottom 1.016: C10.1 82.92,39.6 82.71,39.81
  Bottom 1.27: D3.C 51.41,25.94 51.02,26.32 51.02,26.66 C14.+ 47.41,33.68 46.96,34.12 | 46.96,40.14 46.96,40.3 | 93.44,60.77 97.5,64.84 97.5,70.2 95.19,72.51 C3.+ 93.74,93.95 90.67,97.01 86.76,97.01 R3.1
  Bottom 1.676: 48.91,21.92 D3.C | 48.91,21.92 R16.2 48.91,19.98 47.61,18.69 | 47.61,18.69 47.45,18.52 47.45,16.71 IC4.2 | 48.91,21.92 44.38,21.92 D4.A | C11.+ 89.38,37.73 89.38,34.45 86.29,31.36 58.01,31.36 55.09,34.29 55.09,48.1 53.3,50.21 40.46,50.21 39,48.75 39,45.5 40.95,43.71 45.34,43.71 46.96,42.09 46.96,40.3 | 46.96,40.14 46.96,34.12 47.29,33.8 47.29,30.23 51.51,26 51.51,24.38 49.08,21.94 | 44.52,21.94 49.08,21.94 | 49.08,21.94 48.91,21.77 48.91,20.15 47.61,18.85 47.61,18.69